# Altium schematic sheet mcu_valdis3.SchDoc
size A4; SheetNumber: 4; SheetTotal: 4
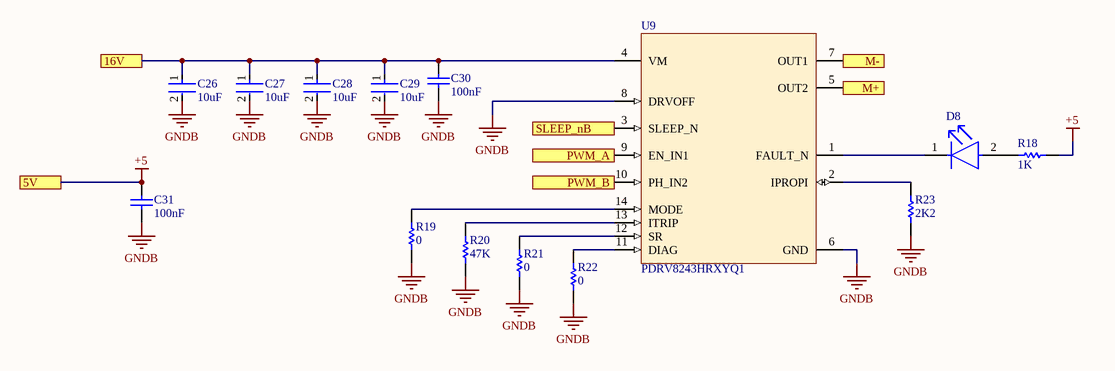
[diagram p0: mcu_valdis3.SchDoc]

## Parts
C26  10uF  [FP-CL21-IPC_C]
C27  10uF  [FP-CL21-IPC_C]
C28  10uF  [FP-CL21-IPC_C]
C29  10uF  [FP-CL21-IPC_C]
C30  100nF  [CAPC1608X90X35ML10T15]
C31  100nF  [CAPC1608X90X35ML10T15]
D8  LTST-C191TBKT  [FP-LTST-C191TBKT-MFG]  (value not drawn)
R18  1K  [RESC1609X50X30NL8T20]
R19  0  [RESC1609X50X30NL8T20]
R20  47K  [RESC1609X50X30NL8T20]
R21  0  [RESC1609X50X30NL8T20]
R22  0  [RESC1609X50X30NL8T20]
R23  2K2  [RESC1609X50X30NL8T20]
U9  PDRV8243HRXYQ1  [RXY0014A-MFG]

## Ports
5V (see mainboard_valdis[3C], mcu_valdis1[1B], mcu_valdis2[1B]), 16V (see mainboard_valdis[3C], mcu_valdis1[1B], mcu_valdis2[1B]), M+ (out, see mainboard_valdis[4C]), M- (out, see mainboard_valdis[4D]), PWM_A (in, see mainboard_valdis[3C]), PWM_B (in, see mainboard_valdis[3D]), SLEEP_nB (in, see mainboard_valdis[3D], mcu_valdis1[2B], mcu_valdis2[2B])

## Nets
+5: C31.2 R18.2 ; port 5V
GNDB: C26.2 C27.2 C28.2 C29.2 C30.1 C31.1 R19.1 R20.1 R21.1 R22.1 R23.1 U9.6(GND) U9.8(DRVOFF)
16V: C26.1 C27.1 C28.1 C29.1 C30.2 U9.4(VM) ; port 16V
M+: U9.5(OUT2) ; port M+
M-: U9.7(OUT1) ; port M-
PWM_A: U9.9(EN_IN1) ; port PWM_A
PWM_B: U9.10(PH_IN2) ; port PWM_B
SLEEP_nB: U9.3(SLEEP_N) ; port SLEEP_nB
NetD8_1: D8.1(C) U9.1(FAULT_N)
NetD8_2: D8.2(A) R18.1
NetR19_2: R19.2 U9.14(MODE)
NetR20_2: R20.2 U9.13(ITRIP)
NetR21_2: R21.2 U9.12(SR)
NetR22_2: R22.2 U9.11(DIAG)
NetR23_2: R23.2 U9.2(IPROPI)

## Library data of the parts
C26-C29 = CMP-13271-003225-1: CL21 Series 0805 22uF 25V ±20% Tolerance X5R Multilayer Ceramic Chip Capacitor
C30 C31 = CMP-2000-04945-1: Chip Capacitor, 22 pF, +/- 5%, 50 V, -55 to 125 degC, 0603 (1608 Metric), RoHS, Tape and Reel; Manufacturer: Murata; Capacitance: 22pF; Rated Voltage: 50V; Dielectric: C0G; Manufacturer URL: http://www.murata.com/; Datasheet Version: Jul-06; Package Reference: 603; Tolerance (%): ±5%; Case Size/Dimension: 0603; Package Description: 2-Pin Surface Mount Device, Body 1.6 x 0.8 mm; Datasheet URL: https://datasheet.ciiva.com/11786/0900766b807a1cab-11786398.pdf
D8 = CMP-22017-000008-1: LED BLUE CLEAR CHIP SMD; Lens Color: Colorless; Dominant Wavelength: 475nm; Forward Current: 20mA; Wavelength: 468nm; Viewing Angle: 130°; Power Dissipation: 76mW; Luminous Intensity: 180mcd; Reverse Voltage: 5V; Number of Elements: 1; Lens Style: Diffused; Forward Voltage: 3.8V; Max Power Dissipation: 75mW; Case Code (Metric): 1608; Packaging: Tape and Reel; Case/Package: 0603; Depth: 1.6mm; Mount: Surface Mount; Lead Free: Lead Free; Min Operating Temperature: -20°C; Lens Transparency: Clear; Illumination Color: Blue; Height: 0.55mm; Test Current: 20mA; Case Code (Imperial): 0603; Max Operating Temperature: 80°C; Number of Pins: 2; Length: 0.8mm; Radiation Hardening: No; Package Quantity: 1; Number of LEDs: 1; Width: 0.8mm; Color: Blue
R18-R23 = CMP-2000-03816-5: Chip Resistor, 0 Ohm, Jumper, 100 mW, -55 to 155 degC, 0603 (1608 Metric), RoHS, Tape and Reel; Manufacturer: Vishay Semiconductor; Voltage Rating: 75 V; Package Quantity: 5000; DatasheetVersion: 06/2012; Min Operating Temperature: -55 degC; ComponentLink1URL: http://www.vishay.com/; Mounting Technology: Surface Mount; Height: 0.45 mm; ComponentLink1Description: Manufacturer URL; REACH SVHC: Unknown; PackageReference: 0603; Packaging: Tape and Reel; Max Operating Temperature: 155 degC; Mount: Surface Mount; ComponentLink2Description: Datasheet; PackageDescription: 2-Pin Surface Mount Device, Body 1.575 x 0.85 mm; Length: 1.55 mm; ComponentLink2URL: http://www.vishay.com/docs/20035/dcrcwe3.pdf; Pins: 2; RoHSCompliant: true
U9 = PDRV8243HRXYQ1: No Description Available; Mfr_Name: Texas Instruments; Type: DEV; RefDes: RefDes; Copyright: Copyright (C) 2022 Ultra Librarian. All rights reserved.; Manufacturer_Part_Number: PDRV8243HRXYQ1